# Altium schematic sheet Intel16_UNI3.SchDoc
size A4; SheetNumber: 7; SheetTotal: 15
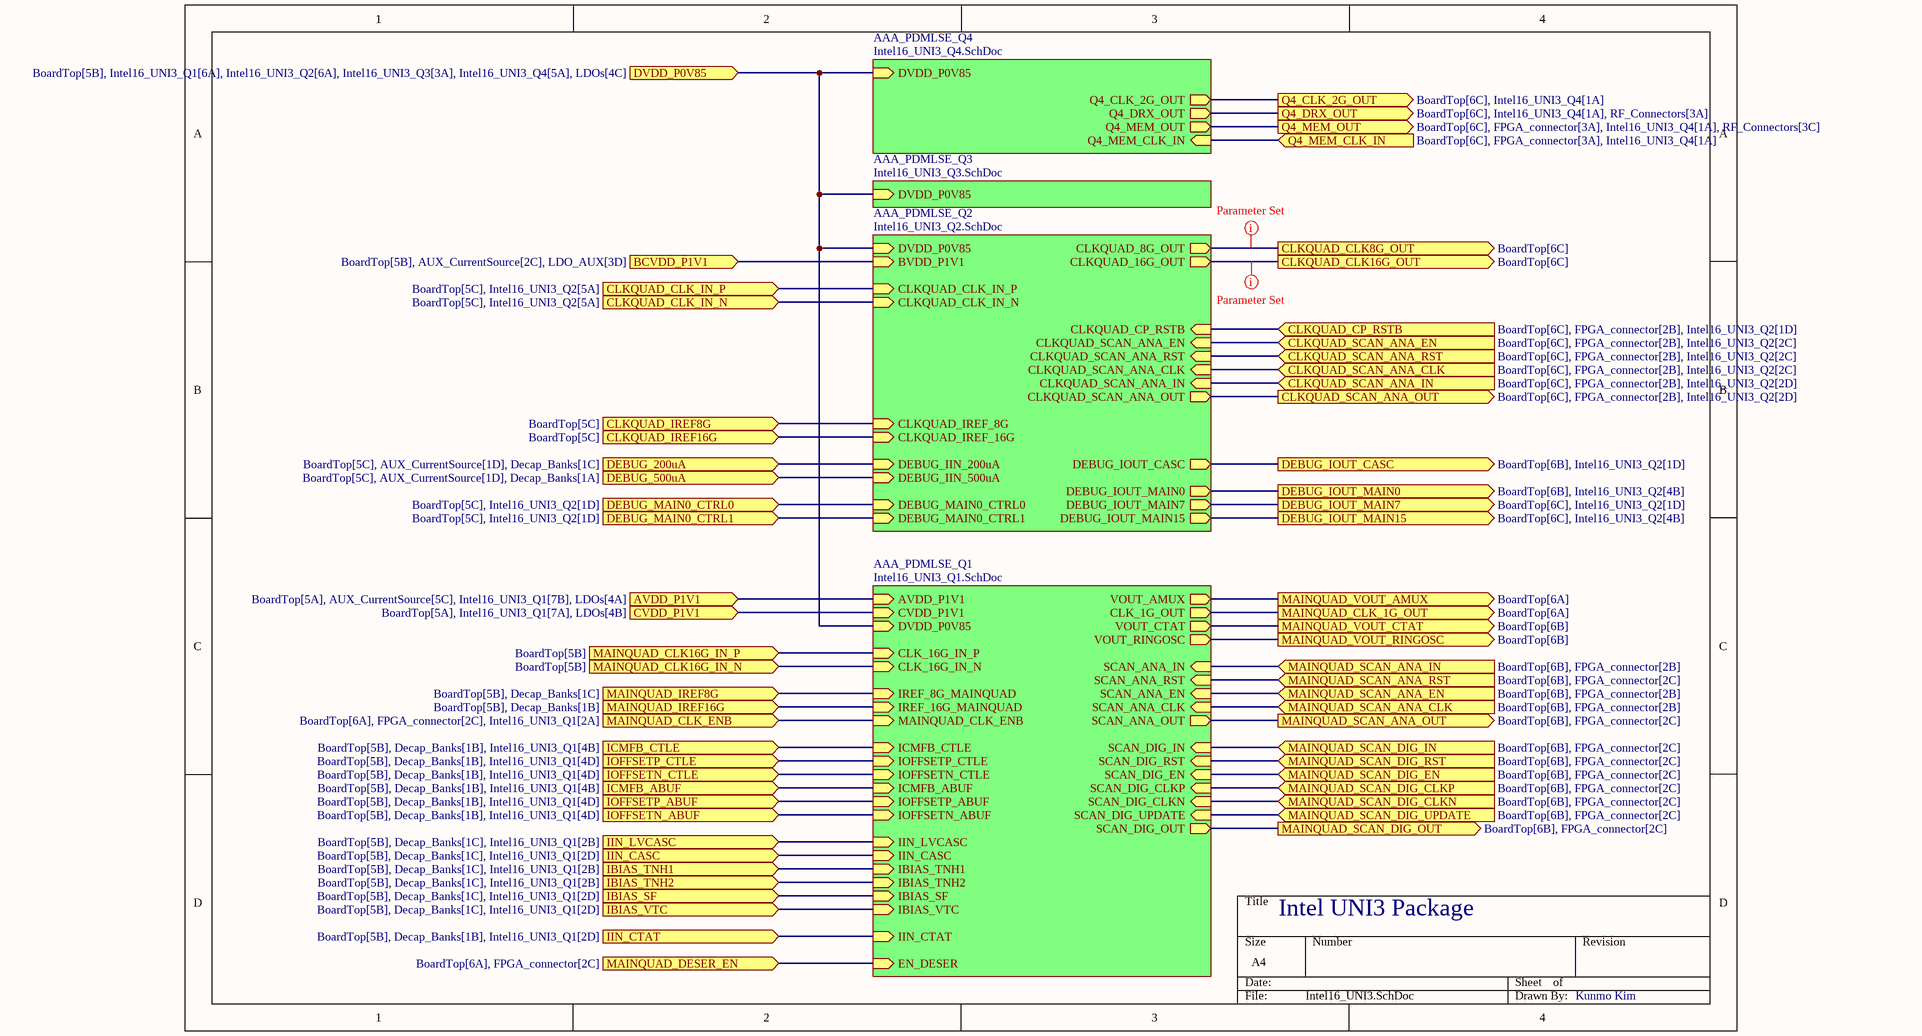
[diagram p0: Intel16_UNI3.SchDoc]

## Sub-sheets
AAA_PDMLSE_Q1 = Intel16_UNI3_Q1.SchDoc: CLK_16G_IN_P (in), DVDD_P0V85 (in), CVDD_P1V1 (in), CLK_16G_IN_N (in), MAINQUAD_CLK_ENB (in), IREF_8G_MAINQUAD (in), IREF_16G_MAINQUAD (in), IBIAS_TNH2 (in), ICMFB_ABUF (in), AVDD_P1V1 (in), IBIAS_TNH1 (in), ICMFB_CTLE (in), IIN_LVCASC (in), SCAN_DIG_OUT (out), SCAN_DIG_UPDATE (in), SCAN_DIG_EN (in), SCAN_DIG_RST (in), SCAN_DIG_CLKP (in), SCAN_DIG_CLKN (in), SCAN_DIG_IN (in), SCAN_ANA_OUT (out), SCAN_ANA_RST (in), SCAN_ANA_IN (in), SCAN_ANA_EN (in), SCAN_ANA_CLK (in), EN_DESER (in), VOUT_RINGOSC (out), IIN_CASC (in), CLK_1G_OUT (out), IIN_CTAT (in), VOUT_AMUX (out), VOUT_CTAT (out), IBIAS_SF (in), IOFFSETP_CTLE (in), IBIAS_VTC (in), IOFFSETN_CTLE (in), IOFFSETN_ABUF (in), IOFFSETP_ABUF (in)
AAA_PDMLSE_Q2 = Intel16_UNI3_Q2.SchDoc: DVDD_P0V85 (in), BVDD_P1V1 (in), CLKQUAD_8G_OUT (out), CLKQUAD_16G_OUT (out), CLKQUAD_CLK_IN_N (in), CLKQUAD_CLK_IN_P (in), CLKQUAD_SCAN_ANA_CLK (in), CLKQUAD_SCAN_ANA_RST (in), CLKQUAD_SCAN_ANA_EN (in), CLKQUAD_SCAN_ANA_OUT (out), CLKQUAD_SCAN_ANA_IN (in), CLKQUAD_IREF_8G (in), CLKQUAD_CP_RSTB (in), CLKQUAD_IREF_16G (in), DEBUG_IIN_200uA (in), DEBUG_IIN_500uA (in), DEBUG_MAIN0_CTRL0 (in), DEBUG_MAIN0_CTRL1 (in), DEBUG_IOUT_CASC (out), DEBUG_IOUT_MAIN7 (out), DEBUG_IOUT_MAIN15 (out), DEBUG_IOUT_MAIN0 (out)
AAA_PDMLSE_Q3 = Intel16_UNI3_Q3.SchDoc: DVDD_P0V85 (in)
AAA_PDMLSE_Q4 = Intel16_UNI3_Q4.SchDoc: DVDD_P0V85 (in), Q4_CLK_2G_OUT (out), Q4_DRX_OUT (out), Q4_MEM_OUT (out), Q4_MEM_CLK_IN (in)

## Ports
AVDD_P1V1 (in, see BoardTop[5A], AUX_CurrentSource[5C], Intel16_UNI3_Q1[7B], LDOs[4A]), BCVDD_P1V1 (in, see BoardTop[5B], AUX_CurrentSource[2C], LDO_AUX[3D]), CLKQUAD_CLK8G_OUT (out, see BoardTop[6C]), CLKQUAD_CLK16G_OUT (out, see BoardTop[6C]), CLKQUAD_CLK_IN_N (in, see BoardTop[5C], Intel16_UNI3_Q2[5A]), CLKQUAD_CLK_IN_P (in, see BoardTop[5C], Intel16_UNI3_Q2[5A]), CLKQUAD_CP_RSTB (in, see BoardTop[6C], FPGA_connector[2B], Intel16_UNI3_Q2[1D]), CLKQUAD_IREF8G (in, see BoardTop[5C]), CLKQUAD_IREF16G (in, see BoardTop[5C]), CLKQUAD_SCAN_ANA_CLK (in, see BoardTop[6C], FPGA_connector[2B], Intel16_UNI3_Q2[2C]), CLKQUAD_SCAN_ANA_EN (in, see BoardTop[6C], FPGA_connector[2B], Intel16_UNI3_Q2[2C]), CLKQUAD_SCAN_ANA_IN (in, see BoardTop[6C], FPGA_connector[2B], Intel16_UNI3_Q2[2D]), CLKQUAD_SCAN_ANA_OUT (out, see BoardTop[6C], FPGA_connector[2B], Intel16_UNI3_Q2[2D]), CLKQUAD_SCAN_ANA_RST (in, see BoardTop[6C], FPGA_connector[2B], Intel16_UNI3_Q2[2C]), CVDD_P1V1 (in, see BoardTop[5A], Intel16_UNI3_Q1[7A], LDOs[4B]), DEBUG_200uA (in, see BoardTop[5C], AUX_CurrentSource[1D], Decap_Banks[1C]), DEBUG_500uA (in, see BoardTop[5C], AUX_CurrentSource[1D], Decap_Banks[1A]), DEBUG_IOUT_CASC (out, see BoardTop[6B], Intel16_UNI3_Q2[1D]), DEBUG_IOUT_MAIN0 (out, see BoardTop[6B], Intel16_UNI3_Q2[4B]), DEBUG_IOUT_MAIN7 (out, see BoardTop[6C], Intel16_UNI3_Q2[1D]), DEBUG_IOUT_MAIN15 (out, see BoardTop[6C], Intel16_UNI3_Q2[4B]), DEBUG_MAIN0_CTRL0 (in, see BoardTop[5C], Intel16_UNI3_Q2[1D]), DEBUG_MAIN0_CTRL1 (in, see BoardTop[5C], Intel16_UNI3_Q2[1D]), DVDD_P0V85 (in, see BoardTop[5B], Intel16_UNI3_Q1[6A], Intel16_UNI3_Q2[6A], Intel16_UNI3_Q3[3A], Intel16_UNI3_Q4[5A], LDOs[4C]), IBIAS_SF (in, see BoardTop[5B], Decap_Banks[1C], Intel16_UNI3_Q1[2D]), IBIAS_TNH1 (in, see BoardTop[5B], Decap_Banks[1C], Intel16_UNI3_Q1[2B]), IBIAS_TNH2 (in, see BoardTop[5B], Decap_Banks[1C], Intel16_UNI3_Q1[2B]), IBIAS_VTC (in, see BoardTop[5B], Decap_Banks[1C], Intel16_UNI3_Q1[2D]), ICMFB_ABUF (in, see BoardTop[5B], Decap_Banks[1B], Intel16_UNI3_Q1[4B]), ICMFB_CTLE (in, see BoardTop[5B], Decap_Banks[1B], Intel16_UNI3_Q1[4B]), IIN_CASC (in, see BoardTop[5B], Decap_Banks[1C], Intel16_UNI3_Q1[2D]), IIN_CTAT (in, see BoardTop[5B], Decap_Banks[1B], Intel16_UNI3_Q1[2D]), IIN_LVCASC (in, see BoardTop[5B], Decap_Banks[1C], Intel16_UNI3_Q1[2B]), IOFFSETN_ABUF (in, see BoardTop[5B], Decap_Banks[1B], Intel16_UNI3_Q1[4D]), IOFFSETN_CTLE (in, see BoardTop[5B], Decap_Banks[1B], Intel16_UNI3_Q1[4D]), IOFFSETP_ABUF (in, see BoardTop[5B], Decap_Banks[1B], Intel16_UNI3_Q1[4D]), IOFFSETP_CTLE (in, see BoardTop[5B], Decap_Banks[1B], Intel16_UNI3_Q1[4D]), MAINQUAD_CLK16G_IN_N (in, see BoardTop[5B]), MAINQUAD_CLK16G_IN_P (in, see BoardTop[5B]), MAINQUAD_CLK_1G_OUT (out, see BoardTop[6A]), MAINQUAD_CLK_ENB (in, see BoardTop[6A], FPGA_connector[2C], Intel16_UNI3_Q1[2A]), MAINQUAD_DESER_EN (in, see BoardTop[6A], FPGA_connector[2C]), MAINQUAD_IREF8G (in, see BoardTop[5B], Decap_Banks[1C]), MAINQUAD_IREF16G (in, see BoardTop[5B], Decap_Banks[1B]), MAINQUAD_SCAN_ANA_CLK (in, see BoardTop[6B], FPGA_connector[2B]), MAINQUAD_SCAN_ANA_EN (in, see BoardTop[6B], FPGA_connector[2B]), MAINQUAD_SCAN_ANA_IN (in, see BoardTop[6B], FPGA_connector[2B]), MAINQUAD_SCAN_ANA_OUT (out, see BoardTop[6B], FPGA_connector[2C]), MAINQUAD_SCAN_ANA_RST (in, see BoardTop[6B], FPGA_connector[2C]), MAINQUAD_SCAN_DIG_CLKN (in, see BoardTop[6B], FPGA_connector[2C]), MAINQUAD_SCAN_DIG_CLKP (in, see BoardTop[6B], FPGA_connector[2C]), MAINQUAD_SCAN_DIG_EN (in, see BoardTop[6B], FPGA_connector[2C]), MAINQUAD_SCAN_DIG_IN (in, see BoardTop[6B], FPGA_connector[2C]), MAINQUAD_SCAN_DIG_OUT (out, see BoardTop[6B], FPGA_connector[2C]), MAINQUAD_SCAN_DIG_RST (in, see BoardTop[6B], FPGA_connector[2C]), MAINQUAD_SCAN_DIG_UPDATE (in, see BoardTop[6B], FPGA_connector[2C]), MAINQUAD_VOUT_AMUX (out, see BoardTop[6A]), MAINQUAD_VOUT_CTAT (out, see BoardTop[6B]), MAINQUAD_VOUT_RINGOSC (out, see BoardTop[6B]), Q4_CLK_2G_OUT (out, see BoardTop[6C], Intel16_UNI3_Q4[1A]), Q4_DRX_OUT (out, see BoardTop[6C], Intel16_UNI3_Q4[1A], RF_Connectors[3A]), Q4_MEM_CLK_IN (in, see BoardTop[6C], FPGA_connector[3A], Intel16_UNI3_Q4[1A]), Q4_MEM_OUT (out, see BoardTop[6C], FPGA_connector[3A], Intel16_UNI3_Q4[1A], RF_Connectors[3C])

## Nets
AVDD_P1V1: port AVDD_P1V1, sheet AAA_PDMLSE_Q1/AVDD_P1V1
BCVDD_P1V1: port BCVDD_P1V1, sheet AAA_PDMLSE_Q2/BVDD_P1V1
CLKQUAD_CLK8G_OUT: port CLKQUAD_CLK8G_OUT, sheet AAA_PDMLSE_Q2/CLKQUAD_8G_OUT
CLKQUAD_CLK16G_OUT: port CLKQUAD_CLK16G_OUT, sheet AAA_PDMLSE_Q2/CLKQUAD_16G_OUT
CLKQUAD_CLK_IN_N: port CLKQUAD_CLK_IN_N, sheet AAA_PDMLSE_Q2/CLKQUAD_CLK_IN_N
CLKQUAD_CLK_IN_P: port CLKQUAD_CLK_IN_P, sheet AAA_PDMLSE_Q2/CLKQUAD_CLK_IN_P
CLKQUAD_CP_RSTB: port CLKQUAD_CP_RSTB, sheet AAA_PDMLSE_Q2/CLKQUAD_CP_RSTB
CLKQUAD_IREF8G: port CLKQUAD_IREF8G, sheet AAA_PDMLSE_Q2/CLKQUAD_IREF_8G
CLKQUAD_IREF16G: port CLKQUAD_IREF16G, sheet AAA_PDMLSE_Q2/CLKQUAD_IREF_16G
CLKQUAD_SCAN_ANA_CLK: port CLKQUAD_SCAN_ANA_CLK, sheet AAA_PDMLSE_Q2/CLKQUAD_SCAN_ANA_CLK
CLKQUAD_SCAN_ANA_EN: port CLKQUAD_SCAN_ANA_EN, sheet AAA_PDMLSE_Q2/CLKQUAD_SCAN_ANA_EN
CLKQUAD_SCAN_ANA_IN: port CLKQUAD_SCAN_ANA_IN, sheet AAA_PDMLSE_Q2/CLKQUAD_SCAN_ANA_IN
CLKQUAD_SCAN_ANA_OUT: port CLKQUAD_SCAN_ANA_OUT, sheet AAA_PDMLSE_Q2/CLKQUAD_SCAN_ANA_OUT
CLKQUAD_SCAN_ANA_RST: port CLKQUAD_SCAN_ANA_RST, sheet AAA_PDMLSE_Q2/CLKQUAD_SCAN_ANA_RST
CVDD_P1V1: port CVDD_P1V1, sheet AAA_PDMLSE_Q1/CVDD_P1V1
DEBUG_200uA: port DEBUG_200uA, sheet AAA_PDMLSE_Q2/DEBUG_IIN_200uA
DEBUG_500uA: port DEBUG_500uA, sheet AAA_PDMLSE_Q2/DEBUG_IIN_500uA
DEBUG_IOUT_CASC: port DEBUG_IOUT_CASC, sheet AAA_PDMLSE_Q2/DEBUG_IOUT_CASC
DEBUG_IOUT_MAIN0: port DEBUG_IOUT_MAIN0, sheet AAA_PDMLSE_Q2/DEBUG_IOUT_MAIN0
DEBUG_IOUT_MAIN7: port DEBUG_IOUT_MAIN7, sheet AAA_PDMLSE_Q2/DEBUG_IOUT_MAIN7
DEBUG_IOUT_MAIN15: port DEBUG_IOUT_MAIN15, sheet AAA_PDMLSE_Q2/DEBUG_IOUT_MAIN15
DEBUG_MAIN0_CTRL0: port DEBUG_MAIN0_CTRL0, sheet AAA_PDMLSE_Q2/DEBUG_MAIN0_CTRL0
DEBUG_MAIN0_CTRL1: port DEBUG_MAIN0_CTRL1, sheet AAA_PDMLSE_Q2/DEBUG_MAIN0_CTRL1
DVDD_P0V85: port DVDD_P0V85, sheet AAA_PDMLSE_Q4/DVDD_P0V85, sheet AAA_PDMLSE_Q3/DVDD_P0V85, sheet AAA_PDMLSE_Q1/DVDD_P0V85, sheet AAA_PDMLSE_Q2/DVDD_P0V85
IBIAS_SF: port IBIAS_SF, sheet AAA_PDMLSE_Q1/IBIAS_SF
IBIAS_TNH1: port IBIAS_TNH1, sheet AAA_PDMLSE_Q1/IBIAS_TNH1
IBIAS_TNH2: port IBIAS_TNH2, sheet AAA_PDMLSE_Q1/IBIAS_TNH2
IBIAS_VTC: port IBIAS_VTC, sheet AAA_PDMLSE_Q1/IBIAS_VTC
ICMFB_ABUF: port ICMFB_ABUF, sheet AAA_PDMLSE_Q1/ICMFB_ABUF
ICMFB_CTLE: port ICMFB_CTLE, sheet AAA_PDMLSE_Q1/ICMFB_CTLE
IIN_CASC: port IIN_CASC, sheet AAA_PDMLSE_Q1/IIN_CASC
IIN_CTAT: port IIN_CTAT, sheet AAA_PDMLSE_Q1/IIN_CTAT
IIN_LVCASC: port IIN_LVCASC, sheet AAA_PDMLSE_Q1/IIN_LVCASC
IOFFSETN_ABUF: port IOFFSETN_ABUF, sheet AAA_PDMLSE_Q1/IOFFSETN_ABUF
IOFFSETN_CTLE: port IOFFSETN_CTLE, sheet AAA_PDMLSE_Q1/IOFFSETN_CTLE
IOFFSETP_ABUF: port IOFFSETP_ABUF, sheet AAA_PDMLSE_Q1/IOFFSETP_ABUF
IOFFSETP_CTLE: port IOFFSETP_CTLE, sheet AAA_PDMLSE_Q1/IOFFSETP_CTLE
MAINQUAD_CLK16G_IN_N: port MAINQUAD_CLK16G_IN_N, sheet AAA_PDMLSE_Q1/CLK_16G_IN_N
MAINQUAD_CLK16G_IN_P: port MAINQUAD_CLK16G_IN_P, sheet AAA_PDMLSE_Q1/CLK_16G_IN_P
MAINQUAD_CLK_1G_OUT: port MAINQUAD_CLK_1G_OUT, sheet AAA_PDMLSE_Q1/CLK_1G_OUT
MAINQUAD_CLK_ENB: port MAINQUAD_CLK_ENB, sheet AAA_PDMLSE_Q1/MAINQUAD_CLK_ENB
MAINQUAD_DESER_EN: port MAINQUAD_DESER_EN, sheet AAA_PDMLSE_Q1/EN_DESER
MAINQUAD_IREF8G: port MAINQUAD_IREF8G, sheet AAA_PDMLSE_Q1/IREF_8G_MAINQUAD
MAINQUAD_IREF16G: port MAINQUAD_IREF16G, sheet AAA_PDMLSE_Q1/IREF_16G_MAINQUAD
MAINQUAD_SCAN_ANA_CLK: port MAINQUAD_SCAN_ANA_CLK, sheet AAA_PDMLSE_Q1/SCAN_ANA_CLK
MAINQUAD_SCAN_ANA_EN: port MAINQUAD_SCAN_ANA_EN, sheet AAA_PDMLSE_Q1/SCAN_ANA_EN
MAINQUAD_SCAN_ANA_IN: port MAINQUAD_SCAN_ANA_IN, sheet AAA_PDMLSE_Q1/SCAN_ANA_IN
MAINQUAD_SCAN_ANA_OUT: port MAINQUAD_SCAN_ANA_OUT, sheet AAA_PDMLSE_Q1/SCAN_ANA_OUT
MAINQUAD_SCAN_ANA_RST: port MAINQUAD_SCAN_ANA_RST, sheet AAA_PDMLSE_Q1/SCAN_ANA_RST
MAINQUAD_SCAN_DIG_CLKN: port MAINQUAD_SCAN_DIG_CLKN, sheet AAA_PDMLSE_Q1/SCAN_DIG_CLKN
MAINQUAD_SCAN_DIG_CLKP: port MAINQUAD_SCAN_DIG_CLKP, sheet AAA_PDMLSE_Q1/SCAN_DIG_CLKP
MAINQUAD_SCAN_DIG_EN: port MAINQUAD_SCAN_DIG_EN, sheet AAA_PDMLSE_Q1/SCAN_DIG_EN
MAINQUAD_SCAN_DIG_IN: port MAINQUAD_SCAN_DIG_IN, sheet AAA_PDMLSE_Q1/SCAN_DIG_IN
MAINQUAD_SCAN_DIG_OUT: port MAINQUAD_SCAN_DIG_OUT, sheet AAA_PDMLSE_Q1/SCAN_DIG_OUT
MAINQUAD_SCAN_DIG_RST: port MAINQUAD_SCAN_DIG_RST, sheet AAA_PDMLSE_Q1/SCAN_DIG_RST
MAINQUAD_SCAN_DIG_UPDATE: port MAINQUAD_SCAN_DIG_UPDATE, sheet AAA_PDMLSE_Q1/SCAN_DIG_UPDATE
MAINQUAD_VOUT_AMUX: port MAINQUAD_VOUT_AMUX, sheet AAA_PDMLSE_Q1/VOUT_AMUX
MAINQUAD_VOUT_CTAT: port MAINQUAD_VOUT_CTAT, sheet AAA_PDMLSE_Q1/VOUT_CTAT
MAINQUAD_VOUT_RINGOSC: port MAINQUAD_VOUT_RINGOSC, sheet AAA_PDMLSE_Q1/VOUT_RINGOSC
Q4_CLK_2G_OUT: port Q4_CLK_2G_OUT, sheet AAA_PDMLSE_Q4/Q4_CLK_2G_OUT
Q4_DRX_OUT: port Q4_DRX_OUT, sheet AAA_PDMLSE_Q4/Q4_DRX_OUT
Q4_MEM_CLK_IN: port Q4_MEM_CLK_IN, sheet AAA_PDMLSE_Q4/Q4_MEM_CLK_IN
Q4_MEM_OUT: port Q4_MEM_OUT, sheet AAA_PDMLSE_Q4/Q4_MEM_OUT

## Layout directives
net class SC50_Ver2: CLKQUAD_CLK8G_OUT, CLKQUAD_CLK16G_OUT

## Notes on the sheet
- Intel UNI3 Package
- Kunmo Kim